# Altium schematic sheet CanRotor_Mini(2).SchDoc: Canrotor_Mini
size A4; Author: WHS; Organization: 깡통로봇연구소; Address1: Korea; Address2: Gwangju; Address3: Cafe; Revision: 7.0; SheetNumber: 2; SheetTotal: 2; ProjectName: CanRotor_Mini
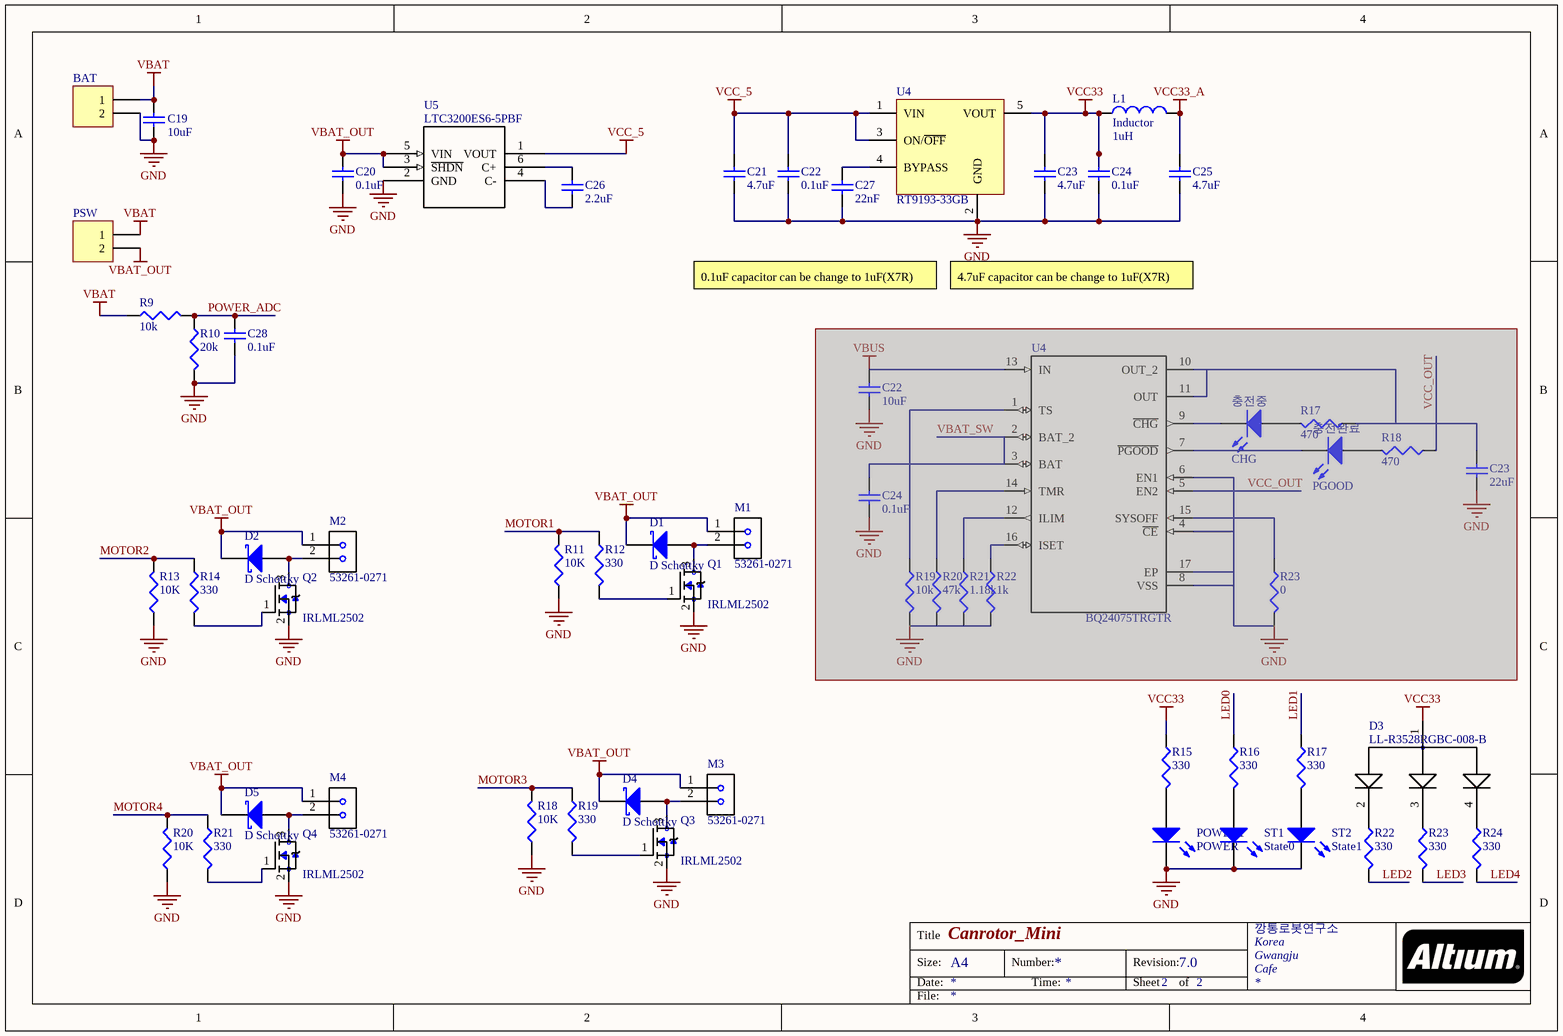
[diagram p0: CanRotor_Mini(2).SchDoc]

## Parts
(Parts that share a designator on the sheet are numbered #1, #2 ... from top to bottom, then left to right.)
BAT  Header 2  [HDR1X2]  (value not drawn)
C19  value 10uF  [6-0805_L]  (hidden comment: Cap Semi)
C20  value 0.1uF  [1608[0603]]  (hidden comment: Cap Semi)
C21  value 4.7uF  [6-0805_L]  (hidden comment: Cap Semi)
C22#1  value 0.1uF  [1608[0603]]  (hidden comment: Cap Semi)
C22#2  value 10uF  [1608[0603]]  (hidden comment: Cap Semi)  (masked out: inside a compile mask, not in the netlist)
C23#1  value 4.7uF  [6-0805_L]  (hidden comment: Cap Semi)
C23#2  value 22uF  [1608[0603]]  (hidden comment: Cap Semi)  (masked out: inside a compile mask, not in the netlist)
C24#1  value 0.1uF  [1608[0603]]  (hidden comment: Cap Semi)
C24#2  value 0.1uF  [1608[0603]]  (hidden comment: Cap Semi)  (masked out: inside a compile mask, not in the netlist)
C25  value 4.7uF  [6-0805_L]  (hidden comment: Cap Semi)
C26  value 2.2uF  [6-0805_M]  (hidden comment: Cap Semi)
C27  value 22nF  [1608[0603]]  (hidden comment: Cap Semi)
C28  value 0.1uF  [1608[0603]]  (hidden comment: Cap Semi)
D1  D Schottky  [1608[0603]]
D2  D Schottky  [Model Name]
D3  LL-R3528RGBC-008-B  [LED_LL-R3528RGBC-008-B]
D4  D Schottky  [1608[0603]]
D5  D Schottky  [1608[0603]]
L1  Inductor  value 1uH  [1608[0603]]
M1  53261-0271  [MOLEX_53261-0271]
M2  53261-0271  [MOLEX_53261-0271]
M3  53261-0271  [MOLEX_53261-0271]
M4  53261-0271  [MOLEX_53261-0271]
POWER1  POWER  [LED0603]
PSW  Header 2  [HDR1X2]  (value not drawn)
Q1  IRLML2502  [SOT23]
Q2  IRLML2502  [SOT23]
Q3  IRLML2502  [SOT23]
Q4  IRLML2502  [SOT23]
R9  value 10k  [J1-0603]  (hidden comment: Res3)
R10  value 20k  [J1-0603]  (hidden comment: Res3)
R11  value 10K  [J1-0603]  (hidden comment: Res3)
R12  value 330  [J1-0603]  (hidden comment: Res3)
R13  value 10K  [J1-0603]  (hidden comment: Res3)
R14  value 330  [J1-0603]  (hidden comment: Res3)
R15  value 330  [J1-0603]  (hidden comment: Res3)
R16  value 330  [J1-0603]  (hidden comment: Res3)
R17#1  value 470  [J1-0603]  (hidden comment: Res3)  (masked out: inside a compile mask, not in the netlist)
R17#2  value 330  [J1-0603]  (hidden comment: Res3)
R18#1  value 470  [J1-0603]  (hidden comment: Res3)  (masked out: inside a compile mask, not in the netlist)
R18#2  value 10K  [J1-0603]  (hidden comment: Res3)
R19#1  value 10k  [J1-0603]  (hidden comment: Res3)  (masked out: inside a compile mask, not in the netlist)
R19#2  value 330  [J1-0603]  (hidden comment: Res3)
R20#1  value 47k  [J1-0603]  (hidden comment: Res3)  (masked out: inside a compile mask, not in the netlist)
R20#2  value 10K  [J1-0603]  (hidden comment: Res3)
R21#1  value 1.18k  [J1-0603]  (hidden comment: Res3)  (masked out: inside a compile mask, not in the netlist)
R21#2  value 330  [J1-0603]  (hidden comment: Res3)
R22#1  value 1k  [J1-0603]  (hidden comment: Res3)  (masked out: inside a compile mask, not in the netlist)
R22#2  value 330  [J1-0603]  (hidden comment: Res3)
R23#1  value 0  [J1-0603]  (hidden comment: Res3)  (masked out: inside a compile mask, not in the netlist)
R23#2  value 330  [J1-0603]  (hidden comment: Res3)
R24  value 330  [J1-0603]  (hidden comment: Res3)
ST1  State0  [LED0603]
ST2  State1  [LED0603]
U4#1  RT9193-33GB  [SOT-23-5]
U4#2  BQ24075TRGTR  [QFN50P300X300X100-17N]  (masked out: inside a compile mask, not in the netlist)
U5  LTC3200ES6-5PBF  [SOT-23_S6]
충전완료  PGOOD  [LED0603]  (masked out: inside a compile mask, not in the netlist)
충전중  CHG  [LED0603]  (masked out: inside a compile mask, not in the netlist)

## Nets
GND: BAT.2 C19.2 C20.2 C21.2 C22#1.2 C23#1.2 C24#1.2 C25.2 C27.2 C28.2 POWER1.2(K) Q1.2(S) Q2.2(S) Q3.2(S) Q4.2(S) R10.2 R11.1 R13.1 R18#2.1 R20#2.1 ST1.2(K) ST2.2(K) U4#1.2(GND) U5.2(GND)
VBAT: BAT.1 C19.1 PSW.1 R9.1
VBAT_OUT: C20.1 D1.2(K) D2.2(K) D4.2(K) D5.2(K) M1.1 M2.1 M3.1 M4.1 PSW.2 U5.3(~{SHDN}) U5.5(VIN)
VCC33: C23#1.1 C24#1.1 D3.1(COMM_ANODE) L1.1 R15.1 U4#1.5(VOUT)
VCC33_A: C25.1 L1.2
VCC_5: C21.1 C22#1.1 U4#1.1(VIN) U4#1.3(ON/~{OFF}) U5.1(VOUT)
LED0: R16.1
LED1: R17#2.1
LED2: R22#2.2
LED3: R23#2.2
LED4: R24.2
MOTOR1: R11.2 R12.1
MOTOR2: R13.2 R14.1
MOTOR3: R18#2.2 R19#2.1
MOTOR4: R20#2.2 R21#2.1
POWER_ADC: C28.1 R9.2 R10.1
NetC26_1: C26.1 U5.6(C+)
NetC26_2: C26.2 U5.4(C-)
NetC27_1: C27.1 U4#1.4(BYPASS)
NetD1_1: D1.1(A) M1.2 Q1.3(D)
NetD2_1: D2.1(A) M2.2 Q2.3(D)
NetD3_2: D3.2(CATHODE_RED) R22#2.1
NetD3_3: D3.3(CATHODE_GREEN) R23#2.1
NetD3_4: D3.4(CATHODE_BLUE) R24.1
NetD4_1: D4.1(A) M3.2 Q3.3(D)
NetD5_1: D5.1(A) M4.2 Q4.3(D)
NetPOWER1_1: POWER1.1(A) R15.2
NetQ1_1: Q1.1(G) R12.2
NetQ2_1: Q2.1(G) R14.2
NetQ3_1: Q3.1(G) R19#2.2
NetQ4_1: Q4.1(G) R21#2.2
NetR16_2: R16.2 ST1.1(A)
NetR17#2_2: R17#2.2 ST2.1(A)

## Notes on the sheet
- 0.1uF capacitor can be change to 1uF(X7R)
- 4.7uF capacitor can be change to 1uF(X7R)
- Title
- Size:
- Date:
- A4
- Number:
- Time:
- Revision:
- Sheet
- of
- File:

## Library data of the parts
BAT PSW = Header 2: Header, 2-Pin; LatestRevisionDate: 17-Jul-2002; LatestRevisionNote: Re-released for DXP Platform.; Publisher: Altium Limited
C19-C21 C22#1 C22#2 C23#1 C23#2 C24#1 C24#2 C25-C28 = Cap Semi: Capacitor (Semiconductor SIM Model); Published: 8-Jun-2000; LatestRevisionDate: 29-May-2009; LatestRevisionNote: IPC-7351 Footprint Added.; PackageReference: C1206; Publisher: Altium Limited; PackageDescription: Chip Capacitor
D1 D2 D4 D5 = D Schottky: Schottky Diode; Published: 8-Jun-2000; LatestRevisionDate: 17-Jul-2002; LatestRevisionNote: Re-released for DXP Platform.; PackageReference: SMB; Publisher: Altium Limited; PackageDescription: DO-214-AA/SMB; 2 C-Bend Leads; Body 5.3 x 3.6 mm, inc. leads (LxW); Code_JEDEC: DO-214-AA
D3 = LL-R3528RGBC-008-B: LED; SMD; 3528, PLCC2; RGB; 3.5x2.8mm; 120째; Red lumin: 1; MF: Lucky Light; SnapEDA_Link: https://www.snapeda.com/parts/LL-R3528RGBC-008-B/Lucky%20Light/view-part/?ref=snap; Package: PLCC-2 Lucky Light; MP: LL-R3528RGBC-008-B; Availability: Unavailable; Price: None; Value: *
L1 = Inductor: Code_IEC: 1005; Published: 8-Jun-2000; LatestRevisionDate: 29-May-2009; LatestRevisionNote: IPC-7351 Footprint Added.; PackageReference: 0402-A; Publisher: Altium Limited; PackageDescription: Chip Inductor; Code_JEITA: 0402
M1-M4 = 53261-0271: Conn Shrouded Header HDR 2 POS 1.25mm Solder RA SMD PicoBlade%E2%84%A2 Embossed T/R; MF: Molex; MP: 53261-0271; Availability: Good; Package: None; Price: 14.02 USD; Value: *
POWER1 ST1 ST2 충전완료 충전중 = LED2: Typical RED, GREEN, YELLOW, AMBER GaAs LED; Published: 8-Jun-2000; LatestRevisionDate: 17-Jul-2002; LatestRevisionNote: Re-released for DXP Platform.; PackageVersion: Feb-2002; PackageReference: 3.2X1.6X1.1; Publisher: Altium Limited; PackageDescription: SM LED; 2 Flat Leads
Q1-Q4 = IRLML2502: MF: International Rectifier; Package: None; MP: IRLML2502; Price: 0.17 USD; Availability: Unavailable; Value: *
R9-R16 R17#1 R17#2 R18#1 R18#2 R19#1 R19#2 R20#1 R20#2 R21#1 R21#2 R22#1 R22#2 R23#1 R23#2 R24 = Res3: Resistor; Published: 8-Jun-2000; LatestRevisionDate: 29-May-2009; LatestRevisionNote: IPC-7351 Footprint Added.; PackageReference: J1-0603; Publisher: Altium Limited; PackageDescription: Chip Resistor
U4#2 = BQ24075TRGTR: 1.5A USB-Friendly Li-Ion Battery Charger and Power-Path Management IC with 4.2 VBAT 16-QFN -40 to 85; MF: Texas Instruments; Availability: Good; MP: BQ24075TRGTR; Price: 1.43 USD; Package: QFN-16 Texas Instruments; Value: *
U5 = LTC3200ES6-5PBF: LTC3200 - Low Noise, Regulated Charge Pump DC/DC Converters; MF: Linear Technology; MP: LTC3200ES6-5#PBF; SnapEDA_Link: https://www.snapeda.com/parts/LTC3200ES6-5%23PBF/Linear%20Technology/view-part/?ref=snap; Package: SOT-23-6 Linear Technology; Availability: Unavailable; Price: None; Value: *